# EasyEDA Pro project stm32f103c8t6-Yingde.eprj

# Schematic Schematic
Create Date: 2024-03-31; Page Name: main; Project Name: stm32f103c8t6-Baiyunshan; Schematic Name: Schematic; Update Date: 2024-04-10; Company: TWOB Studio; Drawed: Jingyi; Page Size: A4; Version: 0.1
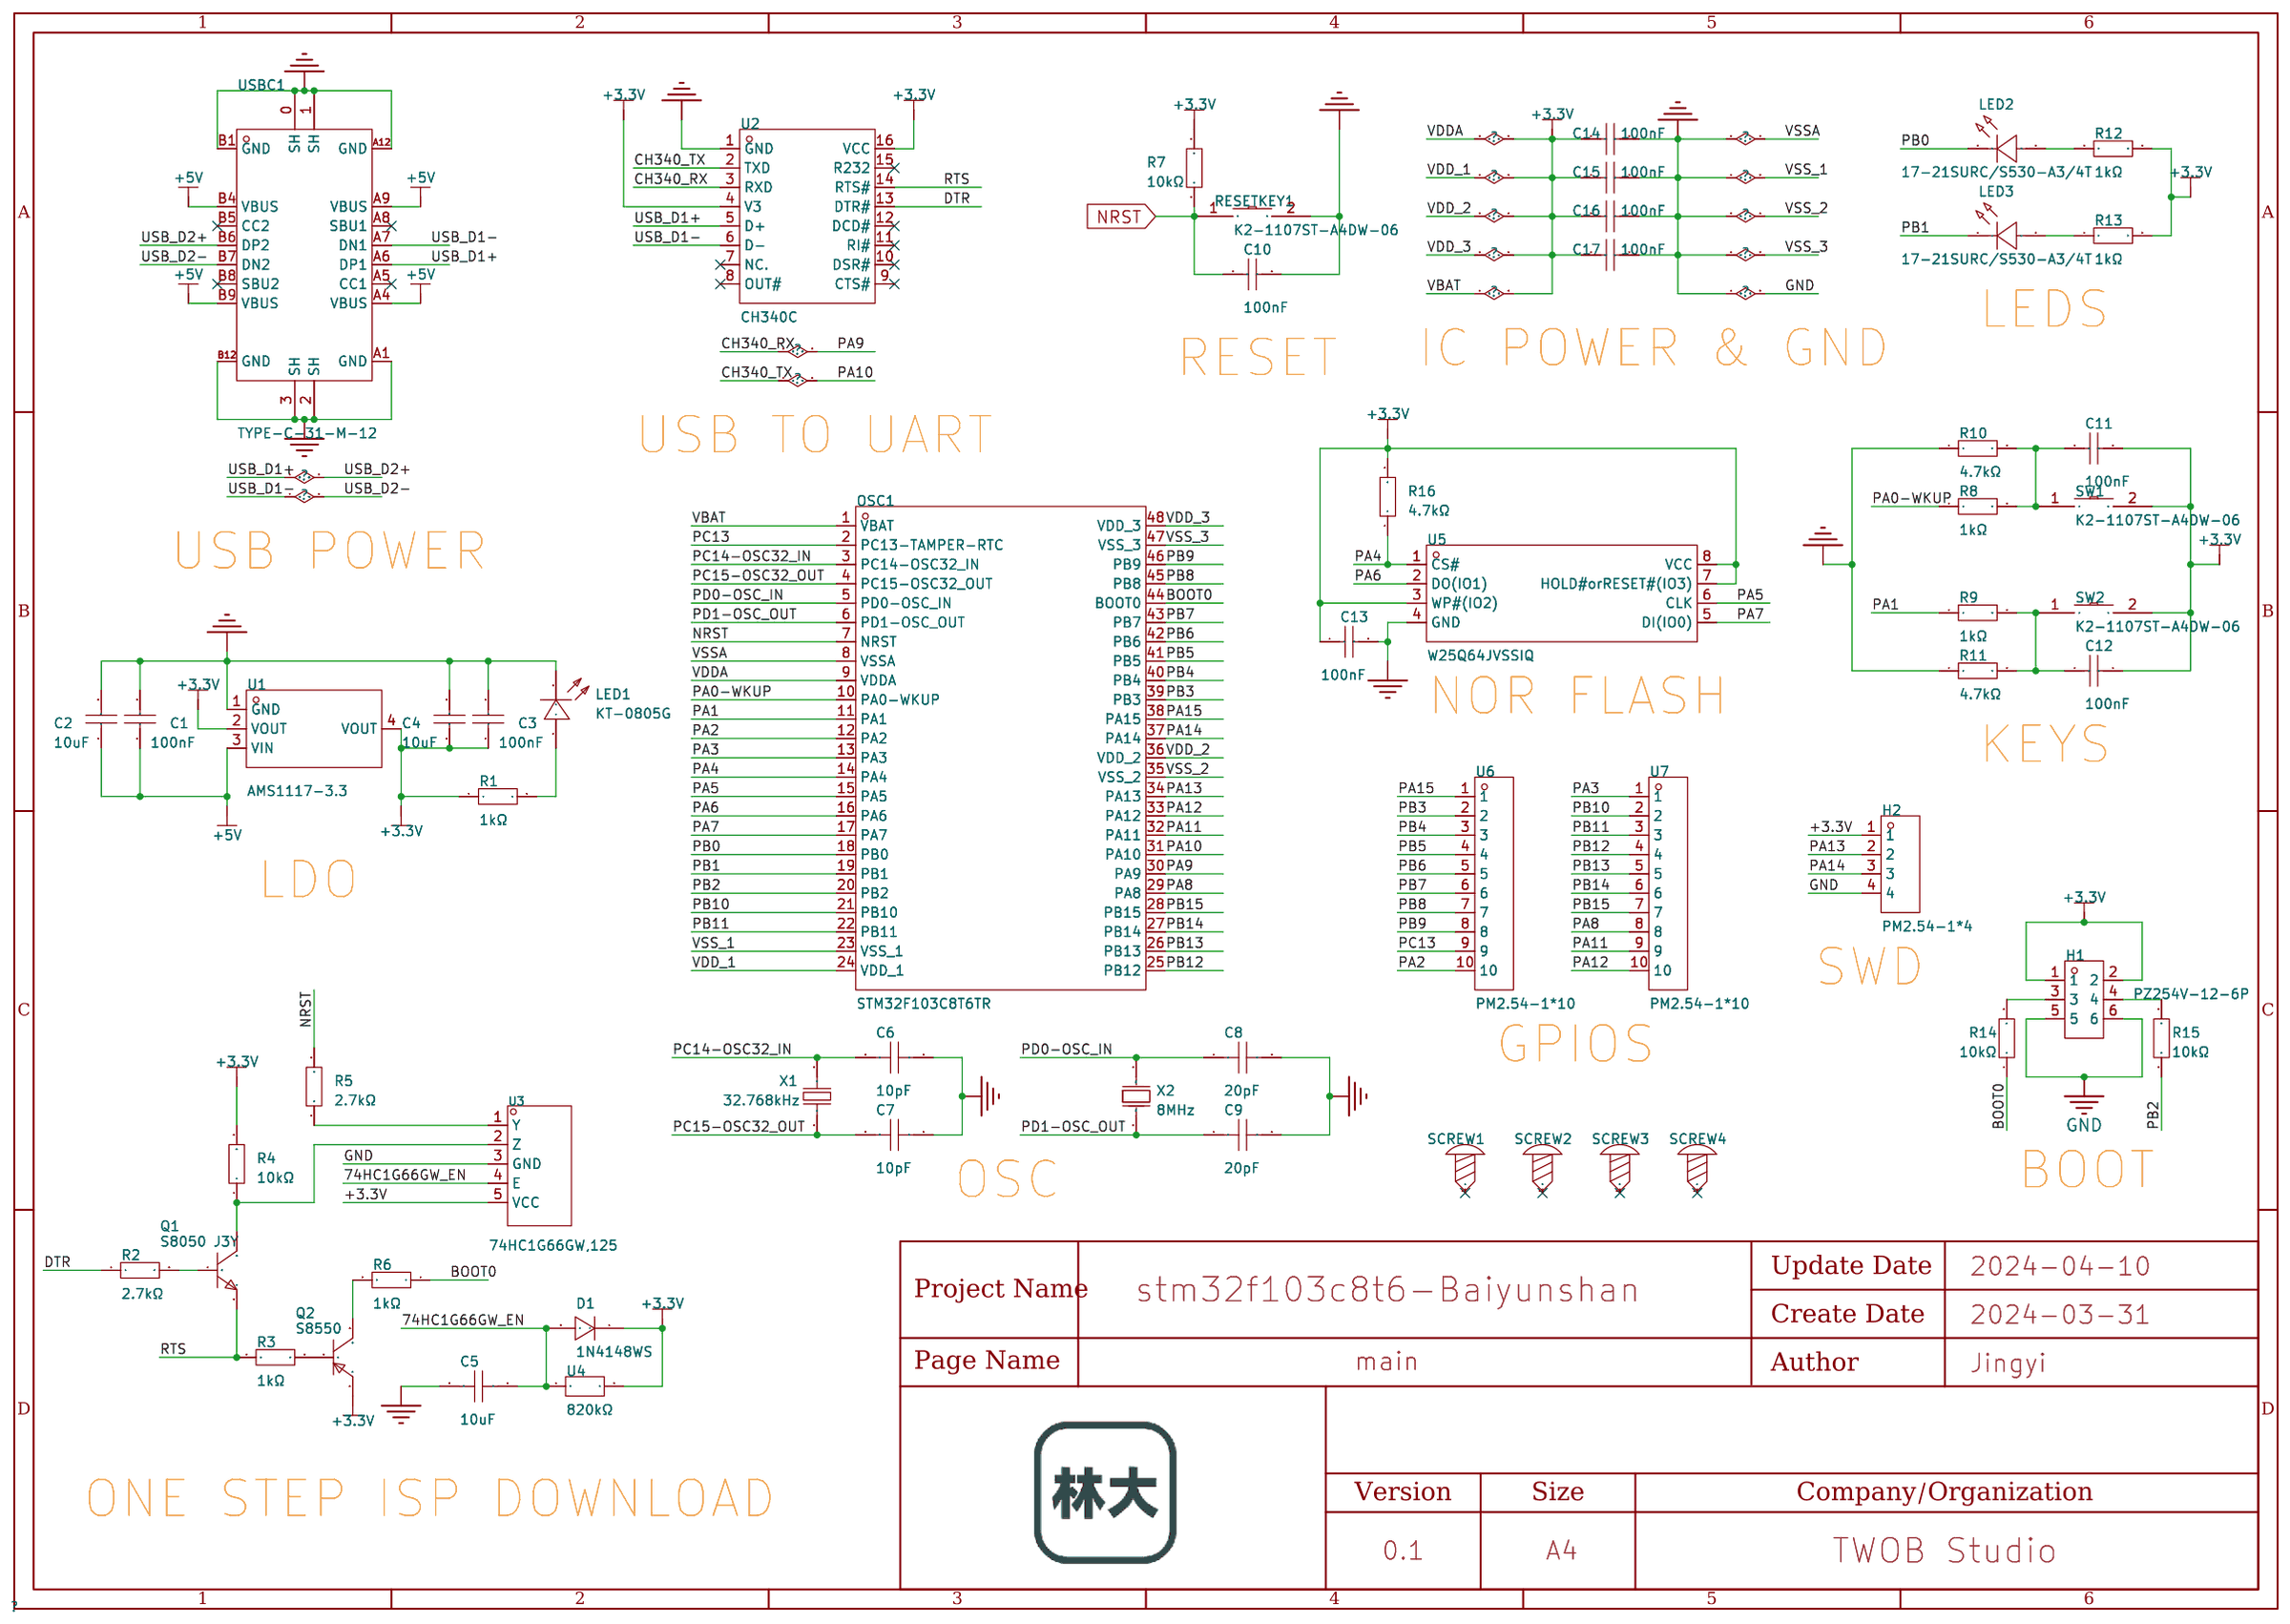
[diagram p0: schematic sheet]

## Parts
C1  100nF  [C0603]
C2  10uF  [C0603]
C3  100nF  [C0603]
C4  10uF  [C0603]
C5  10uF  [C0603]
C6  10pF  [C0603]
C7  10pF  [C0603]
C8  20pF  [C0603]
C9  20pF  [C0603]
C10  100nF  [C0603]
C11  100nF  [C0603]
C12  100nF  [C0603]
C13  100nF  [C0603]
C14  100nF  [C0603]
C15  100nF  [C0603]
C16  100nF  [C0603]
C17  100nF  [C0603]
D1  1N4148WS  [SOD-323_L1.8-W1.3-LS2.5-RD]
H1  PZ254V-12-6P  [HDR-TH_6P-P2.54-V-M-R2-C3-S2.54]
H2  PM2.54-1*4  [HDR-TH_4P-P2.54-V-F]
LED1  KT-0805G  [LED0805-R-RD]
LED2  17-21SURC/S530-A3/4T  [LED0805-RD_ORANGE]
LED3  17-21SURC/S530-A3/4T  [LED0805-RD_ORANGE]
OSC1  STM32F103C8T6TR  [LQFP-48_L7.0-W7.0-P0.50-LS9.0-BL]
Q1  S8050 J3Y  [SOT-23-3_L3.0-W1.7-P0.95-LS2.9-BR]
Q2  S8550  [SOT-23-3_L2.9-W1.6-P1.90-LS2.8-BR]
R1  1kΩ  [R0603]
R2  2.7kΩ  [R0603]
R3  1kΩ  [R0603]
R4  10kΩ  [R0603]
R5  2.7kΩ  [R0603]
R6  1kΩ  [R0603]
R7  10kΩ  [R0603]
R8  1kΩ  [R0603]
R9  1kΩ  [R0603]
R10  4.7kΩ  [R0603]
R11  4.7kΩ  [R0603]
R12  1kΩ  [R0603]
R13  1kΩ  [R0603]
R14  10kΩ  [R0603]
R15  10kΩ  [R0603]
R16  4.7kΩ  [R0603]
RESETKEY1  K2-1107ST-A4DW-06  [KEY-SMD_L6.2-W3.6-LS8.0]
SCREW1  -  [M2螺丝]
SCREW2  -  [M2螺丝]
SCREW3  -  [M2螺丝]
SCREW4  -  [M2螺丝]
SW1  K2-1107ST-A4DW-06  [KEY-SMD_L6.2-W3.6-LS8.0]
SW2  K2-1107ST-A4DW-06  [KEY-SMD_L6.2-W3.6-LS8.0]
U1  AMS1117-3.3  [SOT-223-3_L6.5-W3.4-P2.30-LS7.0-BR]
U2  CH340C  [SOP-16_L10.0-W3.9-P1.27-LS6.0-BL]
U3  74HC1G66GW,125  [SOT-353_L2.1-W1.3-P0.65-LS2.3-BR]
U4  820kΩ  [R0603]
U5  W25Q64JVSSIQ  [SOIC-8_L5.3-W5.3-P1.27-LS8.0-BL]
U6  PM2.54-1*10  [HDR-TH_10P-P2.54-V-F]
U7  PM2.54-1*10  [HDR-TH_10P-P2.54-V-F]
USBC1  TYPE-C-31-M-12  [USB-C_SMD-TYPE-C-31-M-12]
X1  32.768kHz  [FC-135R_L3.2-W1.5]
X2  8MHz  [CRYSTAL-SMD_L5.0-W3.2]

## Library data of the parts
C1 C3 C10-C17 = CC0603KRX7R9BB104: 容值:100nF;精度:±10%;额定电压:50V;材质(温度系数):X7R;; LCSC Part Name: 100nF ±10% 50V; Supplier Part: C14663; Manufacturer: YAGEO(国巨); Supplier Footprint: 0603; JLCPCB Part Class: Basic Part; Datasheet: https://atta.szlcsc.com/upload/public/pdf/source/20180910/C282072_33301C7F631E79921B82A8DAC6BCC5B3.pdf; Supplier: LCSC; Tolerance: ±10%; Voltage Rated: 50V; Temperature Coefficient: X7R
C2 C4 C5 = CL10A106KP8NNNC: 容值:10uF;精度:±10%;额定电压:10V;材质(温度系数):X5R;; LCSC Part Name: 10uF ±10% 10V; Supplier Part: C19702; Manufacturer: SAMSUNG(三星); Supplier Footprint: 0603; JLCPCB Part Class: Basic Part; Datasheet: https://atta.szlcsc.com/upload/public/pdf/source/20160218/1457707763339.pdf; Supplier: LCSC; Tolerance: ±10%; Voltage Rated: 10V; Temperature Coefficient: X5R
C6 C7 = CL10C100JB8NNNC: 容值:10pF;精度:±5%;额定电压:50V;材质(温度系数):C0G;; LCSC Part Name: 10pF ±5% 50V; Supplier Part: C1634; Manufacturer: SAMSUNG(三星); Supplier Footprint: 0603; JLCPCB Part Class: Basic Part; Datasheet: https://atta.szlcsc.com/upload/public/pdf/source/20160218/1457707763339.pdf; Supplier: LCSC; Tolerance: ±5%; Voltage Rated: 50V; Temperature Coefficient: C0G
C8 C9 = CL10C200JB8NNNC: 容值:20pF;精度:±5%;额定电压:50V;材质(温度系数):C0G;; LCSC Part Name: 20pF ±5% 50V; Supplier Part: C1648; Manufacturer: SAMSUNG(三星); Supplier Footprint: 0603; JLCPCB Part Class: Basic Part; Datasheet: https://atta.szlcsc.com/upload/public/pdf/source/20160218/1457707763339.pdf; Supplier: LCSC; Tolerance: ±5%; Voltage Rated: 50V; Temperature Coefficient: C0G
D1 = 1N4148WS_C2128: 二极管配置:独立式;正向压降(Vf):1.25V@150mA;直流反向耐压(Vr):100V;平均整流电流(Io):150mA;功率:200mW;反向恢复时间(trr):4ns;; LCSC Part Name: 电压:100V 电流:150mA; Supplier Part: C2128; Manufacturer: CJ(江苏长电/长晶); Supplier Footprint: SOD-323; JLCPCB Part Class: 基础库; Datasheet: https://atta.szlcsc.com/upload/public/pdf/source/20140809/1457707208178.pdf; Supplier: LCSC; Diode Configuration: 独立式; Forward Voltage (Vf@If): 1.25V@150mA; Reverse Voltage (Vr): 100V; Average Rectified Current (Io): 150mA; Power Dissipation: 200mW; Reverse Leakage Current: 1uA@75V; Reverse Recovery Time (trr): 4ns
H1 = PZ254V-12-6P: 插针结构:2x3P;间距:2.54mm;行距:2.54mm;圆针/方针:方针;安装类型:直插;排数:双排;总PIN位数:6P;额定电流:-;额定电压:-;配合针长度:6mm;塑高:2.5mm;端接针长度:3mm;触头材质:黄铜;触头镀层:-;工作温度范围:-40℃~+105℃;颜色:黑色;; LCSC Part Name: 间距:2.54mm 2x3P 直插 方针; Supplier Part: C492420; Manufacturer: XFCN(兴飞); Supplier Footprint: 插件,P=2.54mm; JLCPCB Part Class: 扩展库; Datasheet: https://atta.szlcsc.com/upload/public/pdf/source/20200309/C492420_BAECB307B001054C09D200388220EAE6.pdf; Supplier: LCSC; Pin Structure: 2x3P; Pitch: 2.54mm; Row Spacing: 2.54mm; Circluar Pins/Square Pins: 方针; Mounting Type: 直插; Number of Rows: 双排; Number of Pins: 6P; Length of Mating Pin: 6mm; Insulation Height: 2.5mm; Length of End Connection Pin: 3mm; Contact Material: 黄铜; Operating Temperature Range: -40℃~+105℃; Color: 黑色
H2 = PM2.54-1*4: 插孔结构:1x4P;间距:2.54mm;行距:2.54mm;圆孔/方孔:方孔;安装类型:直插;排数:单排;总孔位数:4P;额定电流:2.5A;插孔方向:顶部;塑高:8.5mm;工作温度范围:-40℃~+105℃;; LCSC Part Name: 间距:2.54mm 1x4P 直插; Supplier Part: C5116530; Manufacturer: ZHOURI(洲日); Supplier Footprint: 插件,P=2.54mm; JLCPCB Part Class: 扩展库; Datasheet: https://atta.szlcsc.com/upload/public/pdf/source/20220729/3385E3C3A9122AF204A83235A2975C64.pdf; Supplier: LCSC; Holes Structure: 1x4P; Pitch: 2.54mm; Row Spacing: 2.54mm; Circular Hole / Square Hole: 方孔; Mounting Type: 直插; Number of Rows: 单排; Number of Holes: 4P; Current Rating (Max): 2.5A; Holes Direction: 顶部; Insulation Height: 8.5mm; Operating Temperature Range: -40℃~+105℃
LED1 = KT-0805G: 灯头类型:-;发光颜色:翠绿色;正向电压(VF):-;功率:-;正向电流:-;主波长:-;二极管配置:-;透镜颜色:-;色温:-;发光强度:-;发光角度:-;载带方式:-;工作温度:-;; LCSC Part Name: 0805 翠绿 高亮; Supplier Part: C2297; Manufacturer: KENTO; Supplier Footprint: 0805; JLCPCB Part Class: 基础库; Datasheet: https://atta.szlcsc.com/upload/public/pdf/source/20170209/1486607340485.pdf; Supplier: LCSC; Emitted Color: 翠绿色
LED2 LED3 = 17-21SURC/S530-A3/4T: 发光颜色:橙红色;功率:60mW;正向电流:20mA;主波长:624nm;二极管配置:-;透镜颜色:无色透明透镜;色温:-;发光角度:140°;载带方式:正贴;工作温度:-40℃~+85℃;; LCSC Part Name: 橙红 正贴; Supplier Part: C2943978; Manufacturer: EVERLIGHT(亿光); Supplier Footprint: 0805; JLCPCB Part Class: 扩展库; Datasheet: https://atta.szlcsc.com/upload/public/pdf/source/20220318/905DC8A7115F268F033B3130889FCFCC.pdf; Supplier: LCSC; Emitted Color: 橙红色; Power Dissipation: 60mW; Forward Current: 20mA; Dominant Wavelength: 624nm; Peak Wavelength: 632nm; Lens Color: 无色透明透镜; Viewing Angle: 140°; Mounting Sytle: 正贴; Operating Temperature: -40℃~+85℃
OSC1 = STM32F103C8T6TR: CPU内核:CM3;程序存储容量:64KB;RAM总容量:20KB;GPIO端口数量:37;工作电压范围:2V~3.6V;CPU最大主频:72MHz;程序存储器类型:-;; Supplier Part: C2969777; Manufacturer: ST(意法半导体); Supplier Footprint: LQFP-48(7x7); JLCPCB Part Class: 扩展库; Datasheet: https://atta.szlcsc.com/upload/public/pdf/source/20220628/95EE8CB51361BFD20205E6D0986143A8.pdf; Supplier: LCSC; CPU Core: CM3; Program Storage Size: 64KB; RAM Size: 20KB; GPIO Ports Number: 37; Operating Voltage Range: 2V~3.6V; CPU Maximum Speed: 72MHz; Operating Temperature Range: -40℃~+85℃; ADC (Bit): 12bit; Universal Serial Bus: 有; Peripheral/Function: 温度传感器; Watchdog: 有; Infrared Data Association: 有; Low-Voltage Detect: 有; Direct Memory Access: 有; Internal Oscillator: 有
Q1 = S8050 J3Y_C2146: 晶体管类型:NPN;集电极电流(Ic):500mA;集射极击穿电压(Vceo):25V;功率(Pd):300mW;直流电流增益(hFE@Ic,Vce):200@50mA,1V;; LCSC Part Name: S8050 J3Y(RANGE:200-350) H档(200-350); Supplier Part: C2146; Manufacturer: CJ(江苏长电/长晶); Supplier Footprint: SOT-23; JLCPCB Part Class: 基础库; Datasheet: https://atta.szlcsc.com/upload/public/pdf/source/20140809/1457707209234.pdf; Supplier: LCSC; Transistor Type: NPN; Collector Current (Ic): 500mA; Collector-Emitter Breakdown Voltage (Vceo): 25V; Power Dissipation (Pd): 300mW; DC Current Gain (hFE@Ic,Vce): 200@50mA,1V; Transition Frequency (fT): 150MHz; Collector Cut-Off Current (Icbo): 100nA; Collector-Emitter Saturation Voltage (VCE(sat)@Ic,Ib): 600mV@500mA,50mA
Q2 = S8550_C105432: 晶体管类型:PNP;集电极电流(Ic):500mA;集射极击穿电压(Vceo):25V;功率(Pd):300mW;直流电流增益(hFE@Ic,Vce):120@50mA,1V;; LCSC Part Name: S8550(RANGE:120-200) L档120-200; Supplier Part: C105432; Manufacturer: CJ(江苏长电/长晶); Supplier Footprint: SOT-23; JLCPCB Part Class: 基础库; Datasheet: https://atta.szlcsc.com/upload/public/pdf/source/20171228/C164891_15144412930301213894.pdf; Supplier: LCSC; Transistor Type: PNP; Collector Current (Ic): 500mA; Collector-Emitter Breakdown Voltage (Vceo): 25V; Power Dissipation (Pd): 300mW; DC Current Gain (hFE@Ic,Vce): 120@50mA,1V; Transition Frequency (fT): 150MHz; Collector Cut-Off Current (Icbo): 100nA; Collector-Emitter Saturation Voltage (VCE(sat)@Ic,Ib): 600mV@500mA,50mA
R1 R3 R6 R8 R9 R12 R13 = 0603WAF1001T5E: 电阻类型:厚膜电阻;阻值:1kΩ;精度:±1%;功率:100mW;最大工作电压:75V;温度系数:±100ppm/℃;; LCSC Part Name: 1kΩ ±1% 100mW 厚膜电阻; Supplier Part: C21190; Manufacturer: UNI-ROYAL(厚声); Supplier Footprint: 0603; JLCPCB Part Class: Basic Part; Datasheet: https://atta.szlcsc.com/upload/public/pdf/source/20200306/C422600_1E6D84923E4A46A82E41ADD87F860B5C.pdf; Supplier: LCSC; Type: 厚膜电阻; Tolerance: ±1%; Power(Watts): 100mW; Overload Voltage (Max): 75V; Temperature Coefficient: ±100ppm/℃; Operating Temperature Range: -55℃~+155℃
R2 R5 = 0603WAF2701T5E: 电阻类型:厚膜电阻;阻值:2.7kΩ;精度:±1%;功率:100mW;最大工作电压:75V;温度系数:±100ppm/℃;; LCSC Part Name: 2.7kΩ ±1% 100mW 厚膜电阻; Supplier Part: C13167; Manufacturer: UNI-ROYAL(厚声); Supplier Footprint: 0603; JLCPCB Part Class: Basic Part; Datasheet: https://atta.szlcsc.com/upload/public/pdf/source/20200306/C422600_1E6D84923E4A46A82E41ADD87F860B5C.pdf; Supplier: LCSC; Type: 厚膜电阻; Tolerance: ±1%; Power(Watts): 100mW; Overload Voltage (Max): 75V; Temperature Coefficient: ±100ppm/℃; Operating Temperature Range: -55℃~+155℃
R4 R7 R14 R15 = 0603WAF1002T5E: 电阻类型:厚膜电阻;阻值:10kΩ;精度:±1%;功率:100mW;最大工作电压:75V;温度系数:±100ppm/℃;; LCSC Part Name: 厚膜电阻 10kΩ ±1% 100mW; Supplier Part: C25804; Manufacturer: UNI-ROYAL(厚声); Supplier Footprint: 0603; JLCPCB Part Class: Basic Part; Datasheet: https://atta.szlcsc.com/upload/public/pdf/source/20200306/C422600_1E6D84923E4A46A82E41ADD87F860B5C.pdf; Supplier: LCSC; Type: 厚膜电阻; Tolerance: ±1%; Power(Watts): 100mW; Overload Voltage (Max): 75V; Temperature Coefficient: ±100ppm/℃; Operating Temperature Range: -55℃~+155℃
R10 R11 R16 = 0603WAF4701T5E: 电阻类型:厚膜电阻;阻值:4.7kΩ;精度:±1%;功率:100mW;最大工作电压:75V;温度系数:±100ppm/℃;; LCSC Part Name: 4.7kΩ ±1% 100mW 厚膜电阻; Supplier Part: C23162; Manufacturer: UNI-ROYAL(厚声); Supplier Footprint: 0603; JLCPCB Part Class: Basic Part; Datasheet: https://atta.szlcsc.com/upload/public/pdf/source/20200306/C422600_1E6D84923E4A46A82E41ADD87F860B5C.pdf; Supplier: LCSC; Type: 厚膜电阻; Tolerance: ±1%; Power(Watts): 100mW; Overload Voltage (Max): 75V; Temperature Coefficient: ±100ppm/℃; Operating Temperature Range: -55℃~+155℃
RESETKEY1 SW1 SW2 = K2-1107ST-A4DW-06: 电路结构:单刀单掷;按钮形状:矩形按钮;作用力:250gf;安装方式:立贴;开关长度:6.1mm;开关宽度:3.6mm;开关高度:2.5mm;触点电流:50mA;额定电压(DC):12V;绝缘电阻:100MΩ;带灯:-;机械寿命:10万次;; LCSC Part Name: 轻触开关 3.6*6.1*2.5; Supplier Part: C118141; Manufacturer: 韩国韩荣; Supplier Footprint: SMD; JLCPCB Part Class: Extended Part; Datasheet: https://atta.szlcsc.com/upload/public/pdf/source/20210810/381712CEF248770C072B585C3485C888.pdf; Supplier: LCSC; Circuit: 单刀单掷; Actuator Style: 矩形按钮; Operating Force: 250gf; Mounting Style: 立贴; Switch Length: 6.1mm; Switch Width: 3.6mm; Switch Height: 2.5mm; Contact Current: 50mA; Voltage Rating (DC): 12V; Insulation Resistance: 100MΩ; Mechanical Life: 10万次; Operating Temperature: -25℃~+85℃; Strike Gundam: 不带; Actuator/Cap Color: 白色带淡绿
SCREW1-SCREW4 = M2螺丝: Supplier Footprint: 插件
U1 = AMS1117-3.3_C6186: 输出类型:固定;最大输入电压:-;输出电压:3.3V;最大输出电流:1A;电源纹波抑制比(PSRR):72dB@(120Hz);输出极性:正极;; LCSC Part Name: 输出3.3V 1A; Supplier Part: C6186; Manufacturer: AMS; Supplier Footprint: SOT-223-3; JLCPCB Part Class: 基础库; Datasheet: https://atta.szlcsc.com/upload/public/pdf/source/20180727/C6186_7A095716F0823C02F1997A905E26C086.pdf; Supplier: LCSC; Output Type: 固定; Output Voltage: 3.3V; MAX Output Current: 1A; Power Supply Rejection Ratio (PSRR): 72dB@(120Hz); Dropout Voltage: 1.3V@(800mA); Output Polarity: 正极; Number of Outputs: 1
U2 = CH340C: 应用功能:收发器;接口协议:USB 2.0;数据速率:2Mbps;; LCSC Part Name: CH340C USB转串口芯片 CH340; Supplier Part: C84681; Manufacturer: WCH(南京沁恒); Supplier Footprint: SOP-16; JLCPCB Part Class: 扩展库; Datasheet: https://atta.szlcsc.com/upload/public/pdf/source/20200819/C84681_ADBED554CE321879DBD6B1D06488689C.pdf; Supplier: LCSC; Applications Function: 收发器; Protocol: USB 2.0; Supply Voltage: 3.3V；5V; Data Rate: 2Mbps
U3 = 74HC1G66GW,125: 开关电路:单刀单掷(SPST)-常开;通道数:1;导通电阻(Ron@VCC):80Ω;; Supplier Part: C18566; Manufacturer: Nexperia(安世); Supplier Footprint: SOT-353; JLCPCB Part Class: 扩展库; Datasheet: https://atta.szlcsc.com/upload/public/pdf/source/20160918/1474166836525.pdf; Supplier: LCSC; Switch Circuit: 单刀单掷(SPST)-常开; Number of Channels: 1; Supply Voltage: 2V~10V; Turn-on time: 20ns; On-State Resistance (Max): 80Ω; Turn-off time: 20ns
U4 = RC0603FR-07820KL: 电阻类型:厚膜电阻;阻值:820kΩ;精度:±1%;功率:100mW;最大工作电压:75V;温度系数:±100ppm/℃;; LCSC Part Name: 厚膜电阻 820kΩ ±1% 100mW; Supplier Part: C141684; Manufacturer: YAGEO(国巨); Supplier Footprint: 0603; JLCPCB Part Class: Extended Part; Datasheet: https://atta.szlcsc.com/upload/public/pdf/source/20180821/C275644_0D56F95EFF785E7D9A1FEF436B37DA78.pdf; Supplier: LCSC; Type: 厚膜电阻; Tolerance: ±1%; Power(Watts): 100mW; Overload Voltage (Max): 75V; Temperature Coefficient: ±100ppm/℃; Operating Temperature Range: -55℃~+155℃
U5 = W25Q64JVSSIQ: Supplier Part: C179171; Manufacturer: WINBOND(华邦); Supplier Footprint: SOIC-8-208mil; JLCPCB Part Class: 扩展库; Datasheet: https://atta.szlcsc.com/upload/public/pdf/source/20191218/C179171_92C5C91D0324539EDD8F1160D2E79C0F.pdf; Supplier: LCSC
U6 U7 = PM2.54-1*10: 插孔结构:1x10P;间距:2.54mm;行距:2.54mm;圆孔/方孔:方孔;安装类型:直插;排数:单排;总孔位数:10P;额定电流:2.5A;插孔方向:顶部;塑高:8.5mm;工作温度范围:-40℃~+105℃;; LCSC Part Name: 间距:2.54mm 1x10P 直插; Supplier Part: C5116489; Manufacturer: ZHOURI(洲日); Supplier Footprint: 插件,P=2.54mm; JLCPCB Part Class: 扩展库; Datasheet: https://atta.szlcsc.com/upload/public/pdf/source/20220803/0A90D5F6AD0A236C4C7DDEE7A7CA5EA3.pdf; Supplier: LCSC; Holes Structure: 1x10P; Pitch: 2.54mm; Row Spacing: 2.54mm; Circular Hole / Square Hole: 方孔; Mounting Type: 直插; Number of Rows: 单排; Number of Holes: 10P; Current Rating (Max): 2.5A; Holes Direction: 顶部; Insulation Height: 8.5mm; Operating Temperature Range: -40℃~+105℃
USBC1 = TYPE-C-31-M-12: 连接器类型:Type-C;标准:-;公母:母;端口数量:1;触点数量:16P;安装方式:-;额定电流 - 电源:5A;触头材质:-;触头镀层:-;工作温度范围:-;焊接温度(最大值):-;; LCSC Part Name: Type-C 母; Supplier Part: C165948; Manufacturer: 韩国韩荣; Supplier Footprint: SMD; JLCPCB Part Class: 扩展库; Datasheet: https://atta.szlcsc.com/upload/public/pdf/source/20220525/466408E853115E789EDB0DDC29077C05.pdf; Supplier: LCSC; Connector Type: Type-C; Gender: 母; Number of Ports: 1; Number of Contacts: 16P; Current Rating - Power (Max): 5A
X1 = Q13FC13500004_C32346: 晶振类型:贴片晶振;频率:32.768kHz;常温频差:±20ppm;外接负载电容:12.5pF;; LCSC Part Name: 32.768kHz ±20ppm 12.5pF; Supplier Part: C32346; Manufacturer: EPSON(爱普生); Manufacturer Part: Q13FC13500004; Supplier Footprint: SMD3215-2P; JLCPCB Part Class: 基础库; Datasheet: https://atta.szlcsc.com/upload/public/pdf/source/20190108/C32346_746D6B07EAF90824457A96480007685F.pdf; Supplier: LCSC; Crystal Type: 贴片晶振; Normal temperature Frequency Tolerance: ±20ppm; External load capacitor: 12.5pF; Equivalent Series Resistance (ESR): 70kΩ; Operating Temperature: -40℃~+85℃
X2 = X50328MSB2GI: 晶振类型:贴片晶振;频率:8MHz;常温频差:±10ppm;外接负载电容:20pF;频率稳定度(全温):±50ppm;; LCSC Part Name: 8MHz ±10ppm 20pF YSX530GA; Supplier Part: C115962; Manufacturer: YXC(扬兴晶振); Supplier Footprint: SMD5032; JLCPCB Part Class: 基础库; Datasheet: https://atta.szlcsc.com/upload/public/pdf/source/20230220/0EBFFB9D6D8CE6A211407822BBB6C516.pdf; Supplier: LCSC; Crystal Type: 贴片晶振; Normal temperature Frequency Tolerance: ±10ppm; External load capacitor: 20pF; Frequency Stability(Full temperature range): ±50ppm; Operating Temperature: -40℃~+85℃

## Nets
+3.3V: C3.1 C4.1 C11.2 C12.2 C13.1 C14.1 C15.1 C16.1 C17.1 D1.1(K) H1.1 H1.2 H2.1 OSC1.1(VBAT) OSC1.9(VDDA) OSC1.24(VDD_1) OSC1.36(VDD_2) OSC1.48(VDD_3) Q2.2 R1.1 R4.2 R7.2 R12.2 R13.2 R16.2 SW1.2 SW2.2 U1.2(VOUT) U1.4(VOUT) U2.4(V3) U2.16(VCC) U3.5(VCC) U4.2 U5.3(WP#(IO2)) U5.7(HOLD#orRESET#(IO3)) U5.8(VCC)
+5V: C1.1 C2.1 U1.3(VIN) USBC1.A4(VBUS) USBC1.A9(VBUS) USBC1.B4(VBUS) USBC1.B9(VBUS)
GND: C1.2 C2.2 C3.2 C4.2 C5.2 C6.1 C7.1 C8.2 C9.2 C10.2 C13.2 C14.2 C15.2 C16.2 C17.2 H1.5 H1.6 H2.4 LED1.2(K) OSC1.8(VSSA) OSC1.23(VSS_1) OSC1.35(VSS_2) OSC1.47(VSS_3) R10.1 R11.1 RESETKEY1.2 U1.1(GND) U2.1(GND) U3.3(GND) U5.4(GND) USBC1.0(SH) USBC1.1(SH) USBC1.2(SH) USBC1.3(SH) USBC1.A1(GND) USBC1.A12(GND) USBC1.B1(GND) USBC1.B12(GND)
74HC1G66GW_EN: C5.1 D1.2(A) U3.4(E) U4.1
BOOT0: OSC1.44(BOOT0) R6.1 R14.1
CH340_RX: OSC1.30(PA9) U2.3(RXD)
CH340_TX: OSC1.31(PA10) U2.2(TXD)
DTR: R2.1 U2.13(DTR#)
NRST: C10.1 OSC1.7(NRST) R5.2 R7.1 RESETKEY1.1
PA0-WKUP: OSC1.10(PA0-WKUP) R8.1
PA1: OSC1.11(PA1) R9.1
PA2: OSC1.12(PA2) U6.10
PA3: OSC1.13(PA3) U7.1
PA4: OSC1.14(PA4) R16.1 U5.1(CS#)
PA5: OSC1.15(PA5) U5.6(CLK)
PA6: OSC1.16(PA6) U5.2(DO(IO1))
PA7: OSC1.17(PA7) U5.5(DI(IO0))
PA8: OSC1.29(PA8) U7.8
PA11: OSC1.32(PA11) U7.9
PA12: OSC1.33(PA12) U7.10
PA13: H2.2 OSC1.34(PA13)
PA14: H2.3 OSC1.37(PA14)
PA15: OSC1.38(PA15) U6.1
PB0: LED2.1(K) OSC1.18(PB0)
PB1: LED3.1(K) OSC1.19(PB1)
PB2: OSC1.20(PB2) R15.1
PB3: OSC1.39(PB3) U6.2
PB4: OSC1.40(PB4) U6.3
PB5: OSC1.41(PB5) U6.4
PB6: OSC1.42(PB6) U6.5
PB7: OSC1.43(PB7) U6.6
PB8: OSC1.45(PB8) U6.7
PB9: OSC1.46(PB9) U6.8
PB10: OSC1.21(PB10) U7.2
PB11: OSC1.22(PB11) U7.3
PB12: OSC1.25(PB12) U7.4
PB13: OSC1.26(PB13) U7.5
PB14: OSC1.27(PB14) U7.6
PB15: OSC1.28(PB15) U7.7
PC13: OSC1.2(PC13-TAMPER-RTC) U6.9
PC14-OSC32_IN: C6.2 OSC1.3(PC14-OSC32_IN) X1.2
PC15-OSC32_OUT: C7.2 OSC1.4(PC15-OSC32_OUT) X1.1
PD0-OSC_IN: C8.1 OSC1.5(PD0-OSC_IN) X2.1(OSC1)
PD1-OSC_OUT: C9.1 OSC1.6(PD1-OSC_OUT) X2.2(OSC2)
RTS: Q1.2(E) R3.1 U2.14(RTS#)
USB_D1+: U2.5(D+) USBC1.A6(DP1) USBC1.B6(DP2)
USB_D1-: U2.6(D-) USBC1.A7(DN1) USBC1.B7(DN2)
$1N6395: LED1.1(A) R1.2
$1N6413: Q1.1(B) R2.2
$1N6414: Q2.1 R3.2
$1N6418: R5.1 U3.1(Y)
$1N6419: Q1.3(C) R4.1 U3.2(Z)
$1N6554: C11.1 R8.2 R10.2 SW1.1
$1N6555: C12.1 R9.2 R11.2 SW2.1
$1N6558: LED2.2(A) R12.1
$1N6562: LED3.2(A) R13.1
$1N6565: H1.3 R14.2
$1N6657: H1.4 R15.2
$1N31309: Q2.3 R6.2

Not connected (* = marked no-connect by the designer): SCREW1 1*; SCREW2 1*; SCREW3 1*; SCREW4 1*; U2 7(NC.)* 8(OUT#)* 9(CTS#)* 10(DSR#)* 11(RI#)* 12(DCD#)* 15(R232)*; USBC1 A5(CC1)* A8(SBU1)* B5(CC2)* B8(SBU2)*

## Notes on the sheet
- LEDS
- RESET
- IC POWER & GND
- USB TO UART
- USB POWER
- NOR FLASH
- KEYS
- LDO
- SWD
- GPIOS
- OSC
- BOOT
- ONE STEP ISP DOWNLOAD

# Board PCB
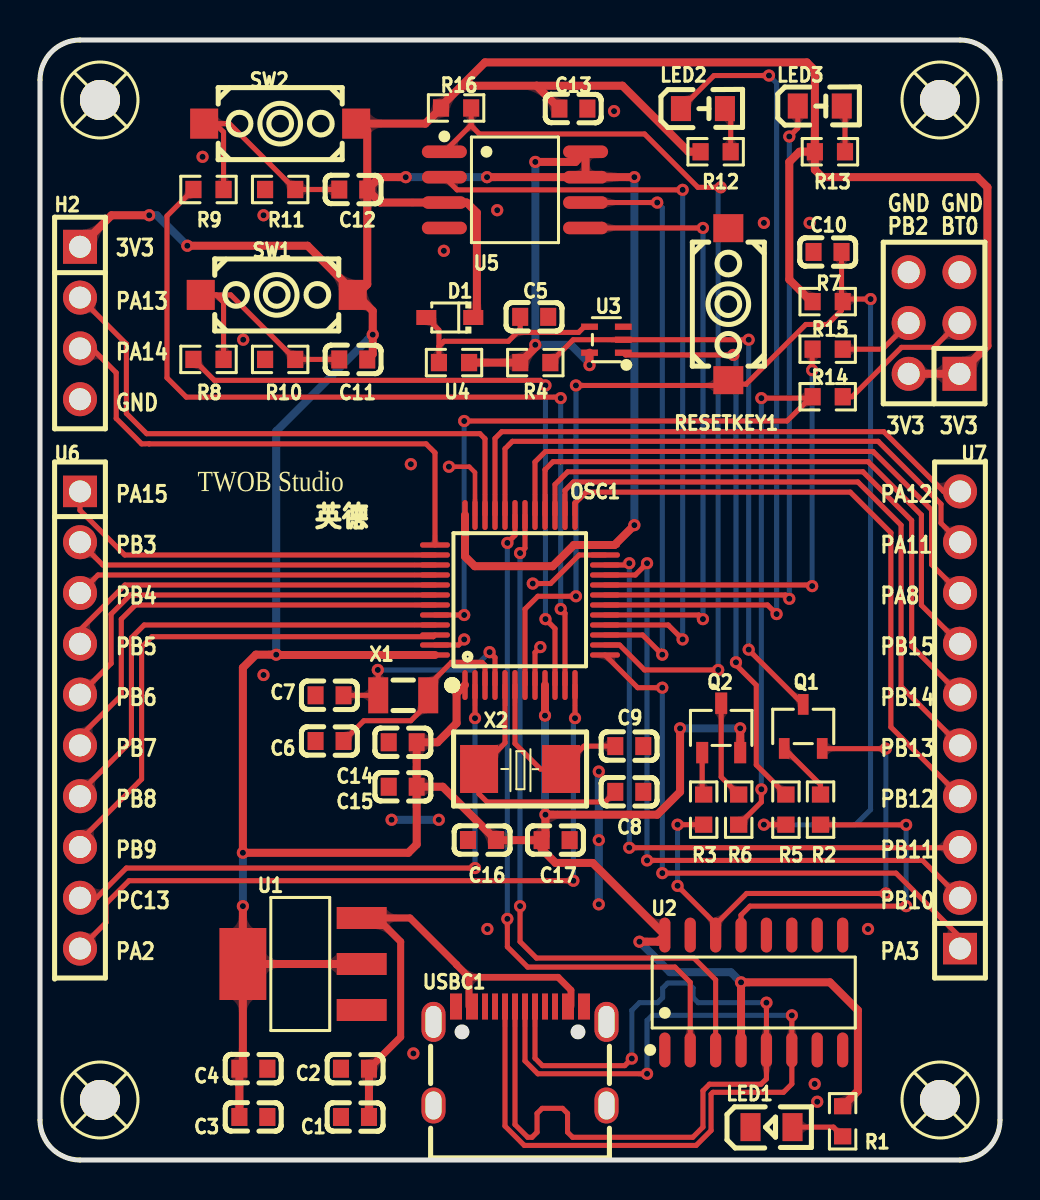
[diagram p1: board, top side]
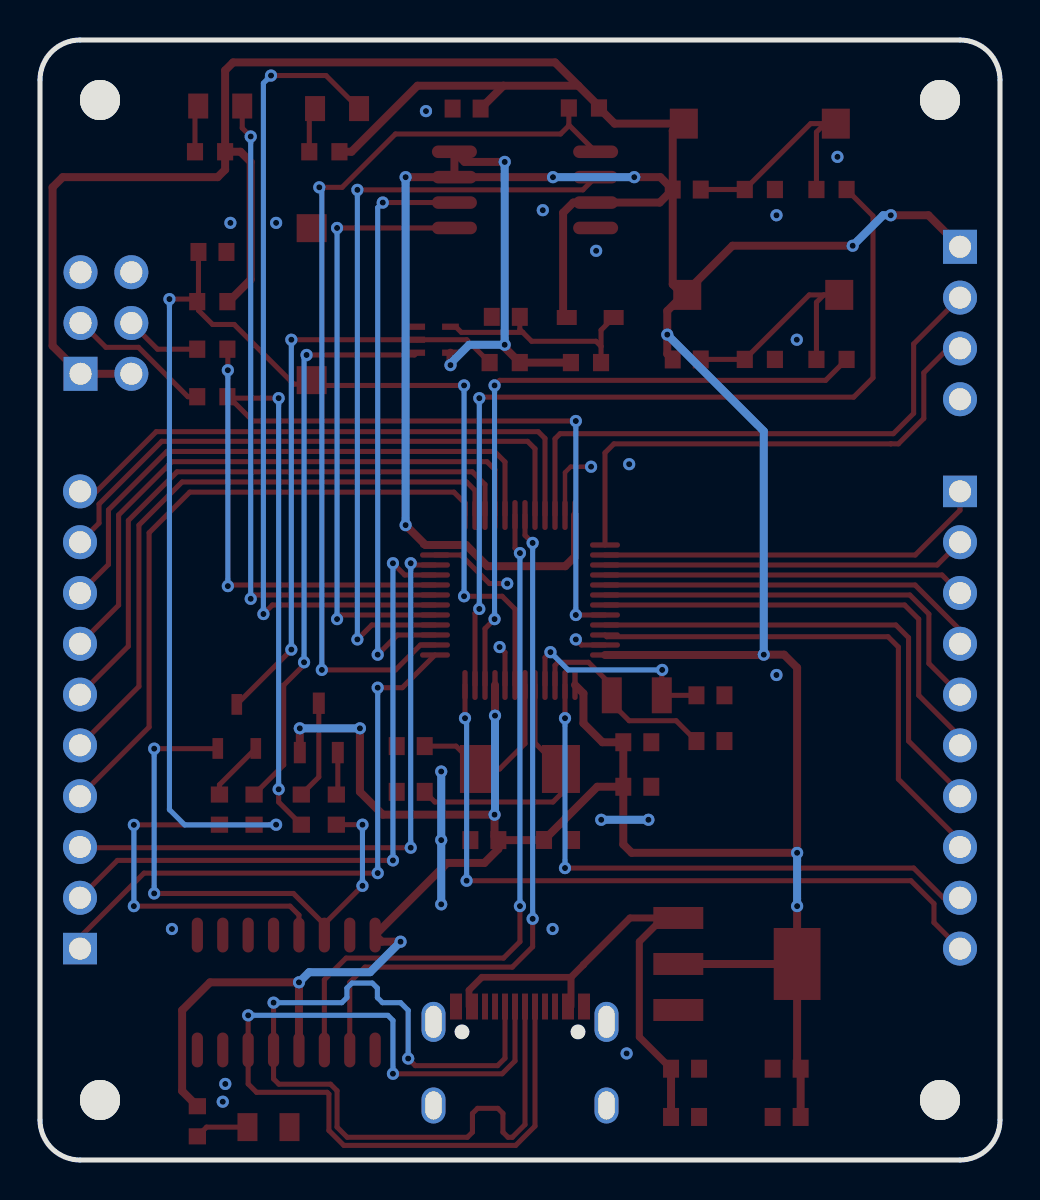
[diagram p2: board, bottom side, seen from below]

Outline 48 x 56 mm; copper layers: Top Layer, Bottom Layer. Coordinates in mm from the lower left corner of the outline.
Outline path: 0,54 0,2 arc(0.59,0.59) 2,0 46,0 arc(47.41,0.59) 48,2 48,54 arc(47.41,55.41) 46,56 2,56 arc(0.59,55.41) 0,54
Stack: Top Layer 0.035mm / Dielectric1 1.51mm FR4 er 4.5 / Bottom Layer 0.035mm

## Design rules (mm)
net USB_D1-: DP1
net USB_D1+: DP1
template: JLCPCB Capability(Two Layers Board)
spacing copperThickness1oz (default): track to track 0.102, other pairs 0.152 to 0.3
spacing copperThickness2oz: track to track 0.203, other pairs 0.152 to 0.3
track width copperThickness1oz (default): min 0.127, default 0.254, max 2.54
track width copperThickness2oz: min 0.203, default 0.254, max 2.54
differential pair differentialPair (default): width min 0.127, default 0.254, max 2.54; gap min 0.152, default 0.152
via viaSize (default): diameter min 0.5, default 0.61, max 10; hole min 0.3, default 0.305, max 6.3

## Placement (name value [footprint] x y rotation side)
C1  100nF  [C0603]  15.75 2.15 180 top
C2  10uF  [C0603]  15.75 4.56 180 top
C3  100nF  [C0603]  10.67 2.15 0 top
C4  10uF  [C0603]  10.67 4.56 0 top
C5  10uF  [C0603]  24.71 42.16 0 top
C6  10pF  [C0603]  14.48 20.95 0 top
C7  10pF  [C0603]  14.48 23.23 0 top
C8  20pF  [C0603]  29.46 18.41 0 top
C9  20pF  [C0603]  29.46 20.69 0 top
C10  100nF  [C0603]  39.38 45.4 180 top
C11  100nF  [C0603]  15.66 40.03 0 top
C12  100nF  [C0603]  15.66 48.52 0 top
C13  100nF  [C0603]  26.67 52.57 0 top
C14  100nF  [C0603]  18.13 20.89 180 top
C15  100nF  [C0603]  18.13 18.66 180 top
C16  100nF  [C0603]  22.1 16 180 top
C17  100nF  [C0603]  25.78 16 0 top
D1  1N4148WS  [SOD-323_L1.8-W1.3-LS2.5-RD]  20.49 42.12 180 top
H1  PZ254V-12-6P  [HDR-TH_6P-P2.54-V-M-R2-C3-S2.54]  44.7 41.85 90 top
H2  PM2.54-1*4  [HDR-TH_4P-P2.54-V-F]  2 41.85 270 top
LED1  KT-0805G  [LED0805-R-RD]  36.58 1.64 0 top
LED2  17-21SURC/S530-A3/4T  [LED0805-RD_ORANGE]  33.15 52.57 0 top
LED3  17-21SURC/S530-A3/4T  [LED0805-RD_ORANGE]  38.99 52.7 0 top
OSC1  STM32F103C8T6TR  [LQFP-48_L7.0-W7.0-P0.50-LS9.0-BL]  24 28 0 top
Q1  S8050 J3Y  [SOT-23-3_L3.0-W1.7-P0.95-LS2.9-BR]  38.16 21.68 270 top
Q2  S8550  [SOT-23-3_L2.9-W1.6-P1.90-LS2.8-BR]  34.06 21.6 270 top
R1  1kΩ  [R0603]  40.13 1.94 270 top
R2  2.7kΩ  [R0603]  39.03 17.52 90 top
R3  1kΩ  [R0603]  33.18 17.52 90 top
R4  10kΩ  [R0603]  24.76 39.87 180 top
R5  2.7kΩ  [R0603]  37.3 17.52 270 top
R6  1kΩ  [R0603]  34.94 17.52 90 top
R7  10kΩ  [R0603]  39.38 42.92 180 top
R8  1kΩ  [R0603]  8.42 40.03 0 top
R9  1kΩ  [R0603]  8.42 48.53 0 top
R10  4.7kΩ  [R0603]  12.01 40.03 0 top
R11  4.7kΩ  [R0603]  12.01 48.53 0 top
R12  1kΩ  [R0603]  33.78 50.41 180 top
R13  1kΩ  [R0603]  39.5 50.41 180 top
R14  10kΩ  [R0603]  39.38 38.16 0 top
R15  10kΩ  [R0603]  39.38 40.54 0 top
R16  4.7kΩ  [R0603]  20.8 52.6 180 top
RESETKEY1  K2-1107ST-A4DW-06  [KEY-SMD_L6.2-W3.6-LS8.0]  34.42 42.79 90 top
SCREW1  -  [M2螺丝]  3 3 0 top
SCREW2  -  [M2螺丝]  45 3 0 top
SCREW3  -  [M2螺丝]  3 53 0 top
SCREW4  -  [M2螺丝]  45 53 0 top
SW1  K2-1107ST-A4DW-06  [KEY-SMD_L6.2-W3.6-LS8.0]  11.84 43.25 0 top
SW2  K2-1107ST-A4DW-06  [KEY-SMD_L6.2-W3.6-LS8.0]  12.01 51.82 0 top
U1  AMS1117-3.3  [SOT-223-3_L6.5-W3.4-P2.30-LS7.0-BR]  13.11 9.8 0 top
U2  CH340C  [SOP-16_L10.0-W3.9-P1.27-LS6.0-BL]  35.69 8.38 0 top
U3  74HC1G66GW,125  [SOT-353_L2.1-W1.3-P0.65-LS2.3-BR]  28.32 41.01 0 top
U4  820kΩ  [R0603]  20.7 39.87 0 top
U5  W25Q64JVSSIQ  [SOIC-8_L5.3-W5.3-P1.27-LS8.0-BL]  23.75 48.51 270 top
U6  PM2.54-1*10  [HDR-TH_10P-P2.54-V-F]  2 22 270 top
U7  PM2.54-1*10  [HDR-TH_10P-P2.54-V-F]  46 22 90 top
USBC1  TYPE-C-31-M-12  [USB-C_SMD-TYPE-C-31-M-12]  24 5.2 0 top
X1  32.768kHz  [FC-135R_L3.2-W1.5]  18.16 23.23 0 top
X2  8MHz  [CRYSTAL-SMD_L5.0-W3.2]  24 19.55 0 top

## Footprints (pads in the part's own frame, mm; a bottom-side part is the same pattern mirrored in y, then rotated)
C0603
  rect 0.8x0.9 smd: 1(-0.7,0) 2(0.7,0)
CRYSTAL-SMD_L5.0-W3.2
  rect 1.9x2.4 smd: 1(-2.05,0) 2(2.05,0)
FC-135R_L3.2-W1.5
  rect 1x1.8 smd: 1(-1.25,0) 2(1.25,0)
HDR-TH_4P-P2.54-V-F
  rect 1.7x1.7 hole 1.1: 1(-3.81,0)
  round 1.7 hole 1.1: 2(-1.27,0) 3(1.27,0) 4(3.81,0)
HDR-TH_6P-P2.54-V-M-R2-C3-S2.54
  rect 1.7x1.7 hole 1.1: 1(-2.54,-1.27)
  round 1.7 hole 1.1: 2(-2.54,1.27) 3(0,-1.27) 4(0,1.27) 5(2.54,-1.27) 6(2.54,1.27)
HDR-TH_10P-P2.54-V-F
  rect 1.575x1.7 hole 1.1: 1(-11.43,0)
  round 1.7 hole 1.1: 2(-8.89,0) 3(-6.35,0) 4(-3.81,0) 5(-1.27,0) 6(1.27,0) 7(3.81,0) 8(6.35,0) 9(8.89,0) 10(11.43,0)
KEY-SMD_L6.2-W3.6-LS8.0
  rect 1.4x1.5 smd: 1(-3.8,0) 2(3.8,0)
LED0805-R-RD
  rect 1x1.399 smd: 1(1.05,0) 2(-1.05,0)
LED0805-RD_ORANGE
  rect 1x1.25 smd: 1(-1.1,0) 2(1.1,0)
LQFP-48_L7.0-W7.0-P0.50-LS9.0-BL
  oval 0.27x1.5 smd: 1(-2.75,-4.25) 2(-2.25,-4.25) 3(-1.75,-4.25) 4(-1.25,-4.25) 5(-0.75,-4.25) 6(-0.25,-4.25) 7(0.25,-4.25) 8(0.75,-4.25) 9(1.25,-4.25) 10(1.75,-4.25) 11(2.25,-4.25) 12(2.75,-4.25) 25(2.75,4.25) 26(2.25,4.25) 27(1.75,4.25) 28(1.25,4.25) 29(0.75,4.25) 30(0.25,4.25) 31(-0.25,4.25) 32(-0.75,4.25) 33(-1.25,4.25) 34(-1.75,4.25) 35(-2.25,4.25) 36(-2.75,4.25)
  oval 1.5x0.27 smd: 13(4.25,-2.75) 14(4.25,-2.25) 15(4.25,-1.75) 16(4.25,-1.25) 17(4.25,-0.75) 18(4.25,-0.25) 19(4.25,0.25) 20(4.25,0.75) 21(4.25,1.25) 22(4.25,1.75) 23(4.25,2.25) 24(4.25,2.75) 37(-4.25,2.75) 38(-4.25,2.25) 39(-4.25,1.75) 40(-4.25,1.25) 41(-4.25,0.75) 42(-4.25,0.25) 43(-4.25,-0.25) 44(-4.25,-0.75) 45(-4.25,-1.25) 46(-4.25,-1.75) 47(-4.25,-2.25) 48(-4.25,-2.75)
M2螺丝
  round 2 hole 2: 1(0,0)
R0603
  rect 0.806x0.864 smd: 1(-0.753,0) 2(0.753,0)
SOD-323_L1.8-W1.3-LS2.5-RD
  rect 1x0.75 smd: 1(-1.173,0) 2(1.173,0)
SOIC-8_L5.3-W5.3-P1.27-LS8.0-BL
  oval 0.63x2.25 smd: 1(-1.905,-3.53) 2(-0.635,-3.53) 3(0.635,-3.53) 4(1.905,-3.53) 5(1.905,3.53) 6(0.635,3.53) 7(-0.635,3.53) 8(-1.905,3.53)
SOP-16_L10.0-W3.9-P1.27-LS6.0-BL
  oval 0.56x1.745 smd: 1(-4.445,-2.873) 2(-3.175,-2.873) 3(-1.905,-2.873) 4(-0.635,-2.873) 5(0.635,-2.873) 6(1.905,-2.873) 7(3.175,-2.873) 8(4.445,-2.873) 9(4.445,2.873) 10(3.175,2.873) 11(1.905,2.873) 12(0.635,2.873) 13(-0.635,2.873) 14(-1.905,2.873) 15(-3.175,2.873) 16(-4.445,2.873)
SOT-23-3_L2.9-W1.6-P1.90-LS2.8-BR
  rect 1.07x0.6 smd: 1(1.235,-0.95) 2(1.235,0.95) 3(-1.235,0)
SOT-23-3_L3.0-W1.7-P0.95-LS2.9-BR
  rect 1.038x0.532 smd: 1(1.101,-0.95) 2(1.101,0.95) 3(-1.101,0)
SOT-223-3_L6.5-W3.4-P2.30-LS7.0-BR
  rect 2.5x1.1 smd: 1(2.97,-2.3) 2(2.97,0) 3(2.97,2.3)
  rect 2.34x3.6 smd: 4(-2.97,0)
SOT-353_L2.1-W1.3-P0.65-LS2.3-BR
  rect 0.839x0.315 smd: 1(0.845,-0.65) 2(0.845,0) 3(0.845,0.65) 4(-0.845,0.65) 5(-0.845,-0.65)
USB-C_SMD-TYPE-C-31-M-12
  oval 1.2x2 hole 0.8x1.6: 0(-4.325,1.706) 1(4.325,1.706)
  oval 1.2x1.8 hole 0.8x1.4: 2(4.325,-2.474) 3(-4.325,-2.474)
  rect 0.3x1.3 smd: A1(-3.35,2.474) A4(-2.55,2.474) A5(-1.25,2.474) A6(-0.25,2.474) A7(0.25,2.474) A8(1.25,2.474) A9(2.55,2.474) A12(3.35,2.474) B1(3.05,2.474) B4(2.25,2.474) B5(1.75,2.474) B6(0.75,2.474) B7(-0.75,2.474) B8(-1.75,2.474) B9(-2.25,2.474) B12(-3.05,2.474)

## Nets
As in the schematic.

Pads without a net: SCREW1 1; SCREW2 1; SCREW3 1; SCREW4 1; U2 7 8 9 10 11 12 15; USBC1 A5 A8 B5 B8

## Via types
v1: diameter 0.61, hole 0.305, Top Layer to Bottom Layer, 99 vias

## Routing (per net, layer and track width the routed paths; a pad name or vN(x,y) marks a point on that pad's centre or on a via; arc(x,y) is an arc through that point)
+3.3V: length 313.1
  Top Layer w0.4: C3.1 C4.1 10.14,4.74 U1.4 ; 15.84,43.25 16.36,43.78 C12.2 ; 15.84,43.25 13.38,45.71 v1(7.37,45.71) ; 15.84,43.25 16.64,42.45 v1(16.64,41.27) 16.64,40.3 C11.2 ; D1.1 21.84,42.31 21.84,47.36 21.34,47.87 U5.3 17.01,47.87 C12.2 ; OSC1.48 11.83,25.25 v1(11.81,25.27) 10.79,25.27 10.14,24.62 v1(10.14,15.36) 18.41,15.36 18.83,15.78 C15.1 ; 25.08,16 22.8,16 C16.1 20.14,18.66 C15.1 ; 25.08,16 25.08,15.55 25.78,14.85 27.64,14.85 U2.16 30.91,10.92 v1(29.97,10.92) ; 25.08,16 25.27,16.19 v1(25.27,17.27) 30.86,17.27 32,18.41 v1(32,21.58) ; C12.2 16.36,51.46 16.01,51.82 19.27,51.82 R16.2 20.05,52.68 21.08,53.71 ; C12.2 16.98,49.14 v1(18.29,49.14) ; R13.2 38.74,49.51 39.12,49.14 46.86,49.14 47.37,48.63 47.37,40.71 H1.1 H1.2 ; R13.2 37.97,50.41 37.47,49.9 37.47,44.02 38.57,42.92 ; R13.2 38.74,54.48 38.34,54.88 22.25,54.88 21.08,53.71 ; 24.83,53.71 21.08,53.71 ; 24.83,53.71 29.12,53.71 32.43,50.41 R12.2 ; 24.83,53.71 C13.1 ; U4.2 R4.2 24.76,40.62 v1(24.76,40.76) ; C15.1 C14.1 19.88,20.89 20.83,21.84 20.83,23.33 OSC1.1 ; v1(24.76,49.9) 26.77,49.9 U5.8 U5.7 ; R1.1 40.89,3.45 40.89,7.49 39.5,8.88 v1(35.05,8.88) U2.4 ; v1(29.72,49.14) U5.7 ; U5.7 v1(22.35,49.14) ; Q2.2 v1(35.01,21.58) ; U1.4 v1(10.14,12.69) ; U1.4 U1.2 ; OSC1.9 v1(25.25,22.22) ; v1(29.72,31.74) 28.72,30.75 OSC1.24 26.69,30.75 25.63,29.69 21.74,29.69 21.25,30.18 OSC1.36 ; U3.5 v1(27.48,39.74) ; H2.1 3.58,47.24 v1(5.46,47.24)
  Bottom Layer w0.4: v1(16.64,41.27) 11.81,36.44 v1(11.81,25.27) ; v1(5.46,47.24) 5.84,47.24 v1(7.37,45.71) ; v1(10.14,12.69) v1(10.14,15.36) ; v1(24.76,49.9) v1(24.76,40.76) 26.54,40.76 27.56,39.74 v1(27.48,39.74) ; v1(35.05,8.88) 34.54,9.39 31.5,9.39 v1(29.97,10.92) ; v1(29.72,31.74) v1(29.72,49.14) ; v1(25.25,22.22) 25.25,17.29 v1(25.27,17.27) ; v1(35.01,21.58) v1(32,21.58) ; v1(22.35,49.14) v1(18.29,49.14)
+5V: length 25.3
  Top Layer w0.335: 21.45,9.14 25.91,9.14 26.55,8.49 USBC1.A9
  Top Layer w0.35: 16.85,12.1 U1.3 ; 16.85,12.1 18.03,10.92 18.03,6.15 C2.1 ; 16.85,12.1 18.5,12.1 20.83,9.77 20.83,9.76 21.45,9.14 USBC1.A4
  Top Layer w0.4: C1.1 C2.1
GND: length 20.3
  Top Layer w0.226: v1(20.45,34.66) 21.46,34.66 21.75,34.38 OSC1.35
  Top Layer w0.254: OSC1.8 24.75,25.38 v1(25.02,25.65) ; v1(24.64,28.82) 25.53,28.82 26.96,30.25 OSC1.23 ; OSC1.47 20.93,25.75 v1(21.21,26.03)
  Bottom Layer w0.4: v1(17.58,17.01) v1(19.94,17.01) ; v1(27.94,19.42) v1(27.94,16) v1(27.94,12.78)
  vias: v1(8.13,50.16) v1(10.16,41.01) v1(11.18,47.24) v1(11.18,24.25) v1(18.54,34.79) v1(18.67,5.33) v1(20.19,45.46) v1(22.37,11.55) v1(22.86,47.49) v1(28.7,52.44) v1(36.19,46.86) v1(38.48,46.86) v1(38.74,3.8) v1(38.86,2.91) v1(41.4,11.55)
74HC1G66GW_EN: length 11.3
  Top Layer w0.254: U3.4 27.22,41.66 26.93,41.38 23.86,41.38 ; 24.01,42.16 24.01,41.53 23.86,41.38 ; U4.1 19.95,40.68 ; 19.95,40.68 19.95,41.49 D1.2 ; 19.95,40.68 20.2,40.94 23.42,40.94 23.86,41.38
BOOT0: length 53.2
  Top Layer w0.254: v1(36.07,18.53) 36.07,17.9 R6.1 ; 38.5,38.09 37.35,36.95 v1(21.21,36.95) ; 38.5,38.09 v1(36.07,38.09) ; 38.5,38.09 38.57,38.16 ; OSC1.44 v1(21.21,27.25)
  Bottom Layer w0.254: v1(21.21,36.95) v1(21.21,27.25) ; v1(36.07,18.53) v1(36.07,38.09)
CH340_RX: length 35.5
  Top Layer w0.254: OSC1.30 24.25,30.59 v1(24,30.35) ; U2.3 33.78,9.01 32.7,10.1 24.82,10.1 24,10.92 v1(24,12.69)
  Bottom Layer w0.254: v1(24,12.69) v1(24,30.35)
CH340_TX: length 35
  Top Layer w0.254: U2.2 32.51,8.88 31.75,9.64 24.38,9.64 23.37,10.66 v1(23.37,12.06) ; v1(23.37,30.85) 23.75,31.24 OSC1.31
  Bottom Layer w0.254: v1(23.37,12.06) v1(23.37,30.85)
DTR: length 17.8
  Top Layer w0.254: R2.1 39.04,16.76 v1(43.31,16.76) ; v1(43.31,12.69) 35.5,12.69 35.05,12.25 U2.13
  Bottom Layer w0.254: v1(43.31,12.69) v1(43.31,16.76)
NRST: length 68.7
  Top Layer w0.254: OSC1.7 24.25,27.55 24.89,28.19 v1(26.8,28.19) ; R5.2 v1(36.19,16.77) ; 40.08,42.92 40.2,43.05 v1(41.53,43.05) ; 40.08,42.92 40.07,42.92 40.07,42.48 39.37,41.78 38.29,41.78 35.31,38.79 34.42,38.79 34.35,38.73 v1(26.8,38.73) ; 40.08,42.92 C10.1
  Bottom Layer w0.254: v1(36.19,16.77) 36.19,16.76 40.77,16.76 41.53,17.52 v1(41.53,43.05) ; v1(26.8,28.19) v1(26.8,38.73)
PA0-WKUP: length 33.3
  Top Layer w0.254: v1(25.27,38.73) 25.02,38.98 8.72,38.98 7.67,40.03 ; OSC1.10 25.75,26.57 v1(25.27,27.04)
  Bottom Layer w0.254: v1(25.27,27.04) v1(25.27,38.73)
PA1: length 44.5
  Top Layer w0.254: v1(26.03,38.09) 25.98,38.14 7.32,38.14 6.35,39.11 6.35,47.2 7.67,48.53 ; OSC1.11 26.25,27.34 v1(26.03,27.55)
  Bottom Layer w0.254: v1(26.03,27.55) v1(26.03,38.09)
PA2: length 36.5
  Top Layer w0.254: v1(26.67,13.96) 4.45,13.96 3.3,12.81 3.3,11.87 U6.10 ; OSC1.12 v1(26.75,22.09)
  Bottom Layer w0.254: v1(26.67,13.96) 26.67,22.09 v1(26.75,22.09)
PA3: length 29.6
  Top Layer w0.254: v1(31.12,14.34) 42.8,14.34 46,11.14 U7.1 ; v1(31.12,23.61) 29.88,23.61 OSC1.13
  Bottom Layer w0.254: v1(31.12,23.61) v1(31.12,14.34)
PA4: length 46.9
  Top Layer w0.254: v1(34.04,48.63) 32.89,48.63 30.23,51.3 21.97,51.3 21.56,51.71 21.56,51.75 ; v1(33.91,24.5) 30.23,24.5 28.98,25.75 OSC1.14 ; U5.1 21.56,51.75 ; 21.56,51.75 R16.1
  Bottom Layer w0.254: v1(34.04,48.63) 33.91,48.51 v1(33.91,24.5)
PA5: length 29.6
  Top Layer w0.254: v1(31.12,25.27) 30.13,26.25 OSC1.15 ; v1(30.86,47.87) U5.6
  Bottom Layer w0.254: v1(30.86,47.87) 31.12,47.62 v1(31.12,25.27)
PA6: length 38.8
  Top Layer w0.254: OSC1.16 31.41,26.75 v1(32.13,26.03) ; U5.2 20.85,48.51 v1(32.13,48.51)
  Bottom Layer w0.254: v1(32.13,26.03) v1(32.13,48.51)
PA7: length 30.4
  Top Layer w0.254: v1(33.15,46.6) U5.5 ; OSC1.17 32.94,27.25 v1(33.15,27.04)
  Bottom Layer w0.254: v1(33.15,27.04) v1(33.15,46.6)
PA8: length 28.7
  Top Layer w0.254: OSC1.29 24.75,34.9 25.27,35.43 41.66,35.43 44.58,32.5 44.58,29.77 U7.8
PA11: length 28.9
  Top Layer w0.254: U7.9 45.05,31.84 45.05,32.8 41.91,35.93 23.62,35.93 23.25,35.56 OSC1.32
PA12: length 28.5
  Top Layer w0.254: U7.10 45.18,33.43 42.19,36.42 23.09,36.42 22.75,36.08 OSC1.33
PA13: length 29
  Top Layer w0.254: H2.2 4.32,40.8 4.32,37.33 5.33,36.31 22,36.31 22.25,36.06 OSC1.34
PA14: length 25.9
  Top Layer w0.254: OSC1.37 19.75,35.36 19.3,35.81 5.46,35.81 5.46,35.81 5.08,35.81 3.81,37.08 3.81,39.36 2.59,40.58 H2.3
PA15: length 19.6
  Top Layer w0.254: U6.1 2,32.49 4.24,30.25 OSC1.38
PB0: length 40.9
  Top Layer w0.254: OSC1.18 36.38,27.75 v1(36.83,27.3) ; v1(36.45,54.22) 33.7,54.22 LED2.1
  Bottom Layer w0.254: v1(36.45,54.22) 36.83,53.84 v1(36.83,27.3)
PB1: length 34.1
  Top Layer w0.254: LED3.1 37.89,51.6 v1(37.47,51.17) ; v1(37.47,28.06) 37.28,28.25 OSC1.19
  Bottom Layer w0.254: v1(37.47,28.06) v1(37.47,51.17)
PB2: length 22.2
  Top Layer w0.254: v1(38.61,39.49) 38.61,40.5 38.57,40.54 ; OSC1.20 38.55,28.75 v1(38.61,28.69)
  Bottom Layer w0.254: v1(38.61,28.69) v1(38.61,39.49)
PB3: length 18.2
  Top Layer w0.254: OSC1.39 3.14,29.75 U6.2
PB4: length 18.1
  Top Layer w0.254: OSC1.40 2.9,29.25 U6.3
PB5: length 19.4
  Top Layer w0.254: OSC1.41 4.25,28.75 2,26.5 U6.4
PB6: length 21.3
  Top Layer w0.254: OSC1.42 4.51,28.25 3.56,27.3 3.56,24.83 U6.5
PB7: length 23.1
  Top Layer w0.254: OSC1.43 4.77,27.75 4.06,27.04 4.06,23.23 2,21.17 U6.6
PB8: length 24.4
  Top Layer w0.254: OSC1.45 5.21,26.75 4.57,26.11 4.57,20.95 2,18.38 U6.7
PB9: length 26.2
  Top Layer w0.254: U6.8 2,15.96 5.08,19.04 5.08,25.65 5.6,26.16 19.66,26.16 OSC1.46
PB10: length 33.6
  Top Layer w0.254: v1(30.35,29.84) 29.76,29.25 OSC1.21 ; U7.2 44.13,14.98 v1(30.35,14.98)
  Bottom Layer w0.254: v1(30.35,29.84) v1(30.35,14.98)
PB11: length 32
  Top Layer w0.254: U7.3 45.96,15.61 v1(29.46,15.61) ; v1(29.46,29.84) 29.38,29.75 OSC1.22
  Bottom Layer w0.254: v1(29.46,29.84) v1(29.46,15.61)
PB12: length 32.1
  Top Layer w0.254: OSC1.25 26.75,32.84 27.31,33.39 40.51,33.39 42.54,31.36 42.54,21.64 U7.4
PB13: length 31.3
  Top Layer w0.254: OSC1.26 26.25,33.48 26.67,33.9 40.89,33.9 43.05,31.74 43.05,23.68 U7.5
PB14: length 30.3
  Top Layer w0.254: U7.6 43.58,25.69 43.58,31.97 41.15,34.41 26.38,34.41 25.75,33.78 OSC1.27
PB15: length 29.7
  Top Layer w0.254: OSC1.28 25.25,34.51 25.65,34.92 26.03,34.92 ; 26.03,34.92 41.4,34.92 44.07,32.25 44.07,27.74 U7.7 ; 26.03,34.92 25.91,34.92
PC13: length 29.5
  Top Layer w0.254: U6.9 2.83,13.11 4.32,14.6 v1(21.75,14.6) ; v1(21.75,22.09) OSC1.2
  Bottom Layer w0.254: v1(21.75,14.6) v1(21.75,22.09)
PC14-OSC32_IN: length 10.3
  Top Layer w0.254: OSC1.3 22.25,24.73 22.1,24.89 20.57,24.89 19.41,23.72 X1.2 19.41,22.83 18.54,21.96 16.19,21.96 C6.2
PC15-OSC32_OUT: length 10.7
  Top Layer w0.254: v1(22.48,25.39) 22.75,25.12 OSC1.4 ; C7.2 X1.1 16.91,24.48 v1(16.89,24.5)
  Bottom Layer w0.254: v1(22.48,25.39) 21.59,24.5 v1(16.89,24.5)
PD0-OSC_IN: length 13.2
  Top Layer w0.254: OSC1.5 23.25,20.85 X2.1 21.95,18.3 22.35,17.9 28.26,17.9 C8.1
PD1-OSC_OUT: length 8.9
  Top Layer w0.254: C9.1 27.2,20.69 X2.2 25.02,19.55 23.75,20.82 OSC1.6
RTS: length 27.2
  Top Layer w0.254: U2.14 33.78,11.78 ; 33.78,11.78 33.78,11.8 v1(31.88,13.71) ; 33.78,11.78 35.33,13.33 v1(42.29,13.33) ; v1(31.88,16.77) R3.1 ; Q1.2 39.12,20.57 v1(42.29,20.57)
  Bottom Layer w0.254: v1(42.29,20.57) v1(42.29,13.33) ; v1(31.88,16.77) v1(31.88,13.71)
USB_D1+: length 45.5
  Top Layer w0.254: USBC1.A6 23.75,1.77 24.38,1.14 24.6,1.14 24.85,1.39 24.85,2.33 25.11,2.58 26.12,2.58 26.38,2.33 26.38,1.39 26.63,1.14 32.64,1.14 33.15,1.64 33.15,3.46 33.47,3.79 36.06,3.79 36.32,4.06 U2.5 v1(36.32,7.87) ; USBC1.B6 24.75,5.09 25.12,4.72 29.24,4.72 v1(29.59,5.07)
  Bottom Layer w0.254: v1(29.59,5.07) 29.59,7.49 29.97,7.87 30.88,7.87 31.13,8.12 31.13,8.59 31.38,8.85 32.4,8.85 32.66,8.59 32.66,8.12 32.91,7.87 v1(36.32,7.87)
USB_D1-: length 45.6
  Top Layer w0.254: USBC1.B7 23.25,1.7 24.22,0.73 32.81,0.73 33.55,1.48 33.55,3.29 33.64,3.38 37.17,3.38 37.59,3.8 U2.6 v1(37.59,7.23) ; USBC1.A7 24.25,4.95 24.89,4.31 v1(30.35,4.31)
  Bottom Layer w0.254: v1(30.35,4.31) 30.35,6.98 30.61,7.23 v1(37.59,7.23)
$1N6395: length 2.7
  Top Layer w0.254: LED1.1 39.67,1.64 R1.2
$1N6413: length 3.1
  Top Layer w0.254: R2.2 39.03,18.76 Q1.1
$1N6414: length 2.1
  Top Layer w0.254: Q2.1 33.11,18.35 R3.2
$1N6418: length 28.6
  Top Layer w0.254: v1(34.67,40.25) 29.28,40.25 U3.1 ; R5.1 35.81,19.75 35.81,23.74 34.8,24.76 v1(34.8,24.89)
  Bottom Layer w0.254: v1(34.67,40.25) 34.8,40.12 v1(34.8,24.89)
$1N6419: length 29.8
  Top Layer w0.254: v1(35.43,25.52) 35.43,25.51 Q1.3 ; R4.1 26.66,41.01 U3.2 v1(35.43,41.01)
  Bottom Layer w0.254: v1(35.43,41.01) v1(35.43,25.52)
$1N6554: length 11.8
  Top Layer w0.254: 7.84,43.25 8.81,43.25 ; 8.81,43.25 9.18,42.89 R8.2 ; 8.81,43.25 9.54,43.25 R10.2 14.96,40.03 C11.1
$1N6555: length 11.8
  Top Layer w0.254: C12.1 14.96,48.53 R11.2 9.47,51.82 8.75,51.82 ; 8.75,51.82 8.01,51.82 ; 8.75,51.82 9.18,51.39 R9.2
$1N6558: length 2.3
  Top Layer w0.254: LED2.2 34.54,52.28 R12.1
$1N6562: length 2.4
  Top Layer w0.254: LED3.2 40.25,52.54 R13.1
$1N6565: length 7.4
  Top Layer w0.254: H1.3 45.92,41.85 44.7,40.63 43.07,40.63 40.6,38.16 40.07,38.16
$1N6657: length 3.9
  Top Layer w0.254: 40.07,40.54 42.13,40.54 H1.4
$1N31309: length 4.9
  Top Layer w0.254: R6.2 34.06,19.15 Q2.3

## Copper pours and planes (outline as drawn; the poured copper is in the pictures)
GND on Top Layer: -0.76,56.76 48.77,56.76 48.77,-0.64 -0.76,-0.64
GND on Bottom Layer: -0.76,56.38 48.64,56.38 48.64,-0.39 -0.76,-0.39

Small or netless copper shapes (teardrops, artwork), in the pictures only: 288 on Top Layer, 83 on Bottom Layer

## Text on the board
Top Silkscreen Layer: 3V3 | PA13 | PA14 | GND | PA15 | PB3 | PB4 | PB5 | PB6 | PB7 | PB8 | PB9 | PC13 | PA2 | PA12 | PA11 | PA8 | PB15 | PB14 | PB13 | PB12 | PB11 | PB10 | PA3 | PB2 | BT0 | TWOB Studio | 英德
